# Altium schematic sheet Power.SchDoc
size A4 portrait; SheetNumber: 2; SheetTotal: 4
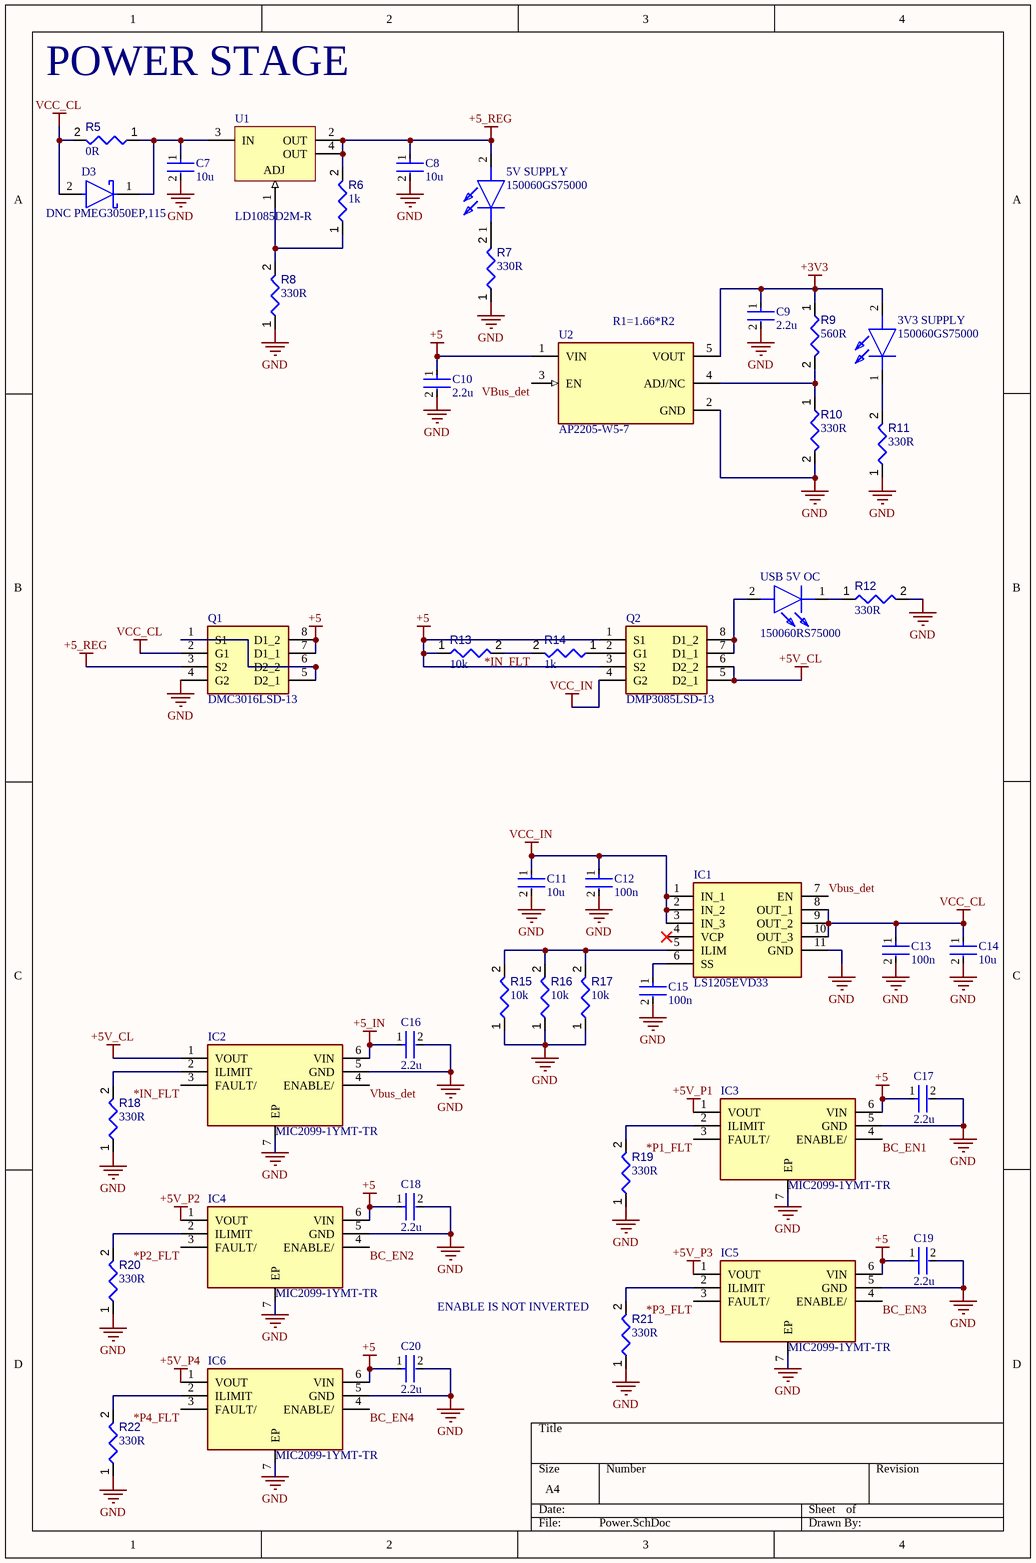
[diagram p0: Power.SchDoc]

## Parts
3V3_SUPPLY  150060GS75000  [LEDC1608X80N]
5V_SUPPLY  150060GS75000  [LEDC1608X80N]
C7  Capacitance: 10u  [1206-C]  (hidden comment: 1206 Capacitor)
C8  Capacitance: 10u  [1206-C]  (hidden comment: 1206 Capacitor)
C9  Capacitance: 2.2u  [0603-C]  (hidden comment: 0603 CAP)
C10  Capacitance: 2.2u  [0603-C]  (hidden comment: 0603 CAP)
C11  Capacitance: 10u  [1206-C]  (hidden comment: 1206 Capacitor)
C12  Capacitance: 100n  [0603-C]  (hidden comment: 0603 CAP)
C13  Capacitance: 100n  [0603-C]  (hidden comment: 0603 CAP)
C14  Capacitance: 10u  [1206-C]  (hidden comment: 1206 Capacitor)
C15  Capacitance: 100n  [0603-C]  (hidden comment: 0603 CAP)
C16  Capacitance: 2.2u  [0603-C]  (hidden comment: 0603 CAP)
C17  Capacitance: 2.2u  [0603-C]  (hidden comment: 0603 CAP)
C18  Capacitance: 2.2u  [0603-C]  (hidden comment: 0603 CAP)
C19  Capacitance: 2.2u  [0603-C]  (hidden comment: 0603 CAP)
C20  Capacitance: 2.2u  [0603-C]  (hidden comment: 0603 CAP)
D3  DNC PMEG3050EP,115  [FP-SOD128-MFG]
IC1  LS1205EVD33  [LS1205EVD33]
IC2  MIC2099-1YMT-TR  [SON50P160X160X60-7N-D]
IC3  MIC2099-1YMT-TR  [SON50P160X160X60-7N-D]
IC4  MIC2099-1YMT-TR  [SON50P160X160X60-7N-D]
IC5  MIC2099-1YMT-TR  [SON50P160X160X60-7N-D]
IC6  MIC2099-1YMT-TR  [SON50P160X160X60-7N-D]
Q1  DMC3016LSD-13  [SOIC127P600X175-8N]
Q2  DMP3085LSD-13  [SOIC127P600X175-8N]
R5  value 0R  [0603-R]  (hidden comment: 0603 Resistor)
R6  value 1k  [0603-R]  (hidden comment: 0603 Resistor)
R7  value 330R  [0603-R]  (hidden comment: 0603 Resistor)
R8  value 330R  [0603-R]  (hidden comment: 0603 Resistor)
R9  value 560R  [0603-R]  (hidden comment: 0603 Resistor)
R10  value 330R  [0603-R]  (hidden comment: 0603 Resistor)
R11  value 330R  [0603-R]  (hidden comment: 0603 Resistor)
R12  value 330R  [0603-R]  (hidden comment: 0603 Resistor)
R13  value 10k  [0603-R]  (hidden comment: 0603 Resistor)
R14  value 1k  [0603-R]  (hidden comment: 0603 Resistor)
R15  value 10k  [0603-R]  (hidden comment: 0603 Resistor)
R16  value 10k  [0603-R]  (hidden comment: 0603 Resistor)
R17  value 10k  [0603-R]  (hidden comment: 0603 Resistor)
R18  value 330R  [0603-R]  (hidden comment: 0603 Resistor)
R19  value 330R  [0603-R]  (hidden comment: 0603 Resistor)
R20  value 330R  [0603-R]  (hidden comment: 0603 Resistor)
R21  value 330R  [0603-R]  (hidden comment: 0603 Resistor)
R22  value 330R  [0603-R]  (hidden comment: 0603 Resistor)
U1  LD1085D2M-R  [D2PAK_A_L]
U2  AP2205-W5-7  [FP-SOT25-MFG]
USB_5V_OC  150060RS75000  [LEDC1608X80N]

## Nets
+3V3: 3V3_SUPPLY.2(A) C9.1 R9.1 U2.5(VOUT)
+5: C10.1 C17.1 C18.1 C19.1 C20.1 IC3.6(VIN) IC4.6(VIN) IC5.6(VIN) IC6.6(VIN) Q1.7(D1_1) Q1.8(D1_2) Q2.1(S1) Q2.3(S2) R13.1 U2.1(VIN)
+5_IN: C16.1 IC2.6(VIN)
+5_REG: 5V_SUPPLY.2(A) C8.1 Q1.3(S2) R6.2 U1.2(OUT) U1.4(OUT)
+5V_CL: IC2.1(VOUT) Q2.5(D2_1) Q2.6(D2_2)
+5V_P1: IC3.1(VOUT)
+5V_P2: IC4.1(VOUT)
+5V_P3: IC5.1(VOUT)
+5V_P4: IC6.1(VOUT)
GND: C7.2 C8.2 C9.2 C10.2 C11.2 C12.2 C13.2 C14.2 C15.2 C16.2 C17.2 C18.2 C19.2 C20.2 IC1.11(GND) IC2.5(GND) IC2.7(EP) IC3.5(GND) IC3.7(EP) IC4.5(GND) IC4.7(EP) IC5.5(GND) IC5.7(EP) IC6.5(GND) IC6.7(EP) Q1.4(G2) R7.1 R8.1 R10.2 R11.1 R12.2 R15.1 R16.1 R17.1 R18.1 R19.1 R20.1 R21.1 R22.1 U2.2(GND)
VCC_CL: C13.1 C14.1 D3.2(A) IC1.8(OUT_1) IC1.9(OUT_2) IC1.10(OUT_3) Q1.2(G1) R5.2
VCC_IN: C11.1 C12.1 IC1.1(IN_1) IC1.2(IN_2) IC1.3(IN_3) Q2.4(G2)
*IN_FLT: IC2.3(FAULT/) R13.2 R14.2
*P1_FLT: IC3.3(FAULT/)
*P2_FLT: IC4.3(FAULT/)
*P3_FLT: IC5.3(FAULT/)
*P4_FLT: IC6.3(FAULT/)
BC_EN1: IC3.4(ENABLE/)
BC_EN2: IC4.4(ENABLE/)
BC_EN3: IC5.4(ENABLE/)
BC_EN4: IC6.4(ENABLE/)
VBus_det: IC1.7(EN) IC2.4(ENABLE/) U2.3(EN)
Net3V3_SUPPLY_1: 3V3_SUPPLY.1(K) R11.2
Net5V_SUPPLY_1: 5V_SUPPLY.1(K) R7.2
NetC7_1: C7.1 D3.1(C) R5.1 U1.3(IN)
NetC15_1: C15.1 IC1.6(SS)
NetIC1_5: IC1.5(ILIM) R15.2 R16.2 R17.2
NetIC2_2: IC2.2(ILIMIT) R18.2
NetIC3_2: IC3.2(ILIMIT) R19.2
NetIC4_2: IC4.2(ILIMIT) R20.2
NetIC5_2: IC5.2(ILIMIT) R21.2
NetIC6_2: IC6.2(ILIMIT) R22.2
NetQ1_1: Q1.1(S1) Q1.5(D2_1) Q1.6(D2_2)
NetQ2_2: Q2.2(G1) R14.1
NetQ2_7: Q2.7(D1_1) Q2.8(D1_2) USB_5V_OC.2(A)
NetR6_1: R6.1 R8.2 U1.1(ADJ)
NetR9_2: R9.2 R10.1 U2.4(ADJ/NC)
NetR12_1: R12.1 USB_5V_OC.1(K)

Not connected (* = marked no-connect by the designer): IC1 4(VCP)*

## Notes on the sheet
- POWER STAGE
- (near U2) R1=1.66*R2
- ENABLE IS NOT INVERTED

## Library data of the parts
3V3_SUPPLY 5V_SUPPLY = 150060GS75000: LED; Manufacturer_Name: Wurth Elektronik; Datasheet Link: https://componentsearchengine.com/Datasheets/2/150060GS75000.pdf; Height: 0.8mm; Manufacturer_Part_Number: 150060GS75000; Mouser Part Number: 710-150060GS75000; Mouser Price/Stock: https://www.mouser.co.uk/ProductDetail/Wurth-Elektronik/150060GS75000?qs=LlUlMxKIyB0UYkq5lDO8nA%3D%3D
C7 C8 C11 C14 = CMP-06035-003589-1: Manufacturer: Murata; Manufacturer Part Number: GRM31CR71E106KA12L; Voltage Rating (DC): 25V; Material: Ceramic; Tolerance: 10%; Dielectric: X7R; Case Code (Imperial): 1206; Voltage Rating: 25V; Length: 3.2mm; Lead Free: Lead Free; Thickness: 0.071inch; Package Quantity: 1; Width: 1.6mm; Max Operating Temperature: 125°C; Number of Pins: 2; Height: 1.6mm; Case Code (Metric): 3216; REACH SVHC: No SVHC; Radiation Hardening: No; Case/Package: 1206; Voltage: 25V; Mount: Surface Mount; Packaging: Tape and Reel; Termination: SMD/SMT; Min Operating Temperature: -55°C; Depth: 1.6mm
C9 C10 C12 C13 C15-C20 = CMP-2006-02792-2: Manufacturer: Murata; Manufacturer Part Number: GRM188R60J106ME47D; Voltage Rating (DC): 6.3V; Dielectric: X5R; Material: Ceramic; Tolerance: 20%; Packaging: Tape and Reel; Width: 0.031inch; Termination: SMD/SMT; Package Quantity: 4000; Voltage Rating: 6.3V; Case/Package: 0603; Min Operating Temperature: -55°C; Voltage: 6.3V; Length: 1.6mm; Thickness: 0.035inch; Lead Free: Lead Free; Depth: 0.8mm; Case Code (Imperial): 0603; Max Operating Temperature: 85°C; Height: 0.8mm; Mount: Surface Mount; REACH SVHC: No SVHC; Radiation Hardening: No; Case Code (Metric): 1608
D3 = CMP-14398-000051-1: DIODE SCHOTTKY 30V 5A SOD128; RoHS Compliant: Yes
IC1 = LS1205EVD33: Integrated Circuit; Manufacturer_Name: LITTELFUSE; Datasheet Link: https://www.littelfuse.com/media?resourcetype=datasheets&itemid=b40a8809-c1ad-459d-a34c-84532dbddcb7&filename=littelfuse-protection-ic-ls1205exd33--datasheet; Height: 0.8mm; Manufacturer_Part_Number: LS1205EVD33
IC2-IC6 = MIC2097-2YMT-TR: **EN is not inverted; Manufacturer_Name: Microchip; Datasheet Link: http://www.microchip.com/mymicrochip/filehandler.aspx?ddocname=en579484; Height: 0.6mm; Manufacturer_Part_Number: MIC2097-2YMT-TR; Mouser Part Number: 998-MIC2097-2YMTTR; Mouser Price/Stock: https://www.mouser.co.uk/ProductDetail/Microchip-Technology-Micrel/MIC2097-2YMT-TR?qs=Y3Q3JoKAO1STlVNIQyVOyQ%3D%3D
Q1 = DMC3016LSD-13: MOSFET (N&P-Channel); Manufacturer_Name: Diodes Inc.; Datasheet Link: https://www.diodes.com/assets/Datasheets/DMC3016LSD.pdf; Height: 1.75mm; Manufacturer_Part_Number: DMC3016LSD-13; Mouser Part Number: 621-DMC3016LSD-13; Mouser Price/Stock: https://www.mouser.co.uk/ProductDetail/Diodes-Incorporated/DMC3016LSD-13?qs=5V6w%252Be2aIqYl%2FV2fEzcwTA%3D%3D; Arrow Part Number: DMC3016LSD-13; Arrow Price/Stock: https://www.arrow.com/en/products/dmc3016lsd-13/diodes-incorporated
Q2 = DMP3085LSD-13: MOSFET (P-Channel); Manufacturer_Name: Diodes Inc.; Datasheet Link: https://www.diodes.com/assets/Datasheets/DMP3085LSD.pdf; Height: 1.75mm; Manufacturer_Part_Number: DMP3085LSD-13; Mouser Part Number: 621-DMP3085LSD-13; Mouser Price/Stock: https://www.mouser.co.uk/ProductDetail/Diodes-Incorporated/DMP3085LSD-13?qs=L1DZKBg7t5H5rh%252BaQZmdng%3D%3D; Arrow Part Number: DMP3085LSD-13; Arrow Price/Stock: https://www.arrow.com/en/products/dmp3085lsd-13/diodes-incorporated?region=nac
R5-R22 = CMP-009-00014-5: Manufacturer: Yageo; Manufacturer Part Number: RC0603FR-071KL; Manufacturer: Panasonic; Manufacturer Part Number: ERJ3EKF1001V; Manufacturer Part Number: RC0603FR-131KL; Voltage Rating: 50V; Power: 100mW; Tolerance: 1%; Mounting Technology: SM; Pins: 2; Case/Package: 0603; Min Operating Temperature: -55°C; RoHS Compliant: True; Max Operating Temperature: 155°C; Component Type: Resistors
U1 = CMP-0244-00500-1: 3A, Low Drop Positive Voltage Regulator, Adjustable Vo, 4-Pin D2PAK/A; ComponentLink1Description: Manufacturer URL; PackageReference: D2PAK_A; ComponentLink1URL: http://www.st.com; ComponentLink2Description: Datasheet; ComponentLink2URL: http://www.st.com/internet/com/TECHNICAL_RESOURCES/TECHNICAL_LITERATURE/DATASHEET/CD00001883.pdf; PackageVersion: 2011; DatasheetVersion: 28/07/2009; PackageDescription: 4-Pin Transistor Outline Package 2.54 mm Pitch, 15.4 mm Lead Span
U2 = CMP-12756-000046-1: IC REG LIN POS ADJ 250MA SOT25
USB_5V_OC = 150060RS75000: LED; Manufacturer_Name: Wurth Elektronik; Datasheet Link: http://katalog.we-online.de/led/datasheet/150060RS75000.pdf; Height: 0.8mm; Manufacturer_Part_Number: 150060RS75000; Mouser Part Number: 710-150060RS75000; Mouser Price/Stock: https://www.mouser.co.uk/ProductDetail/Wurth-Elektronik/150060RS75000?qs=LlUlMxKIyB3QnmZ3fw%2FVCA%3D%3D